# Altium schematic sheet REVISION_HISTORY.SchDoc
size 558 x 431 mm
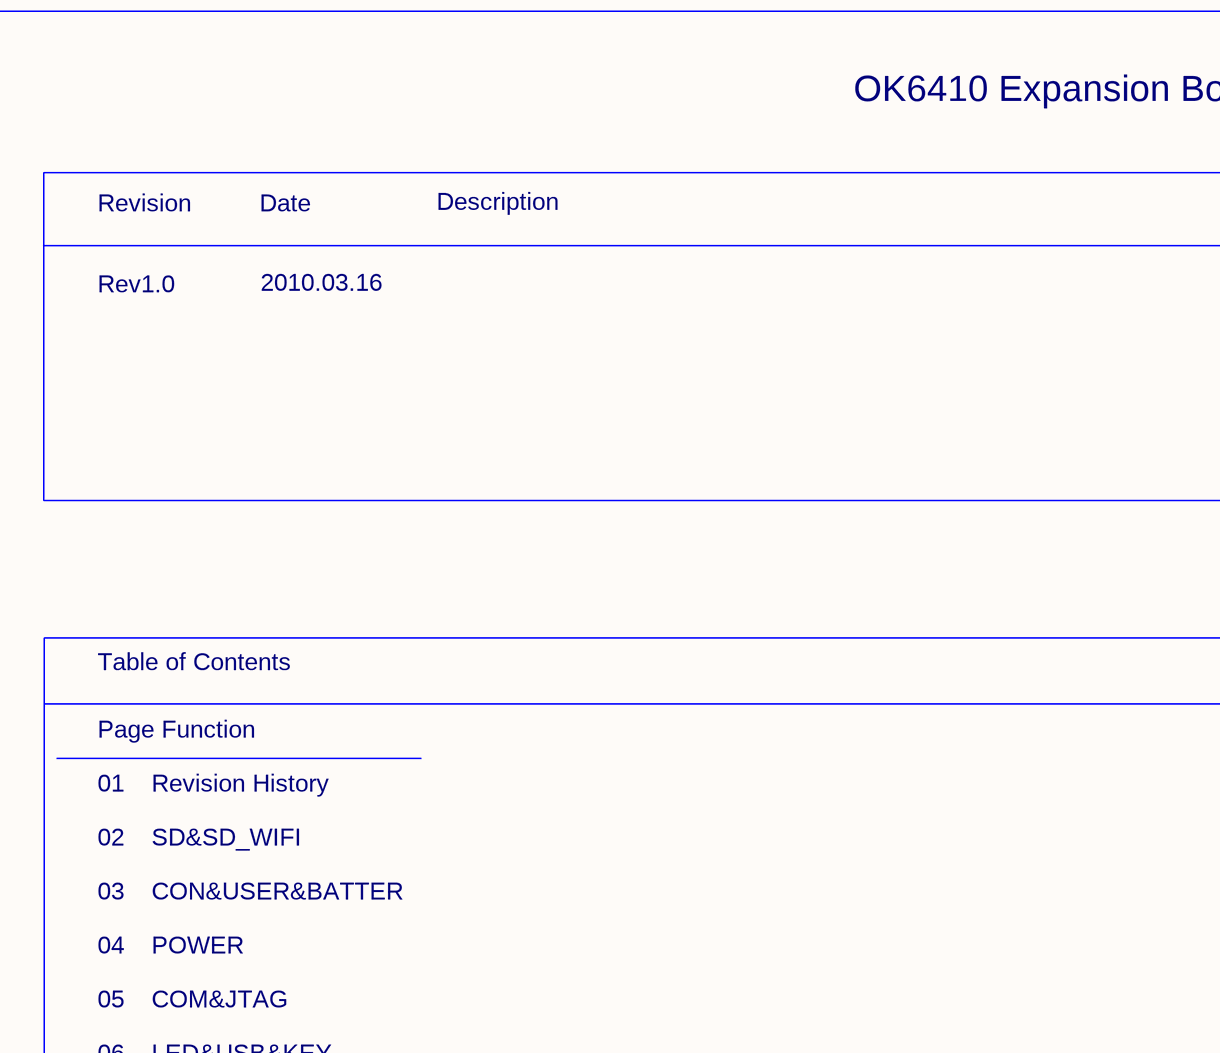
[diagram p0: REVISION_HISTORY.SchDoc, top left]
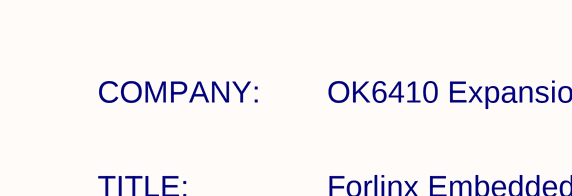
[diagram p1: REVISION_HISTORY.SchDoc, top right]
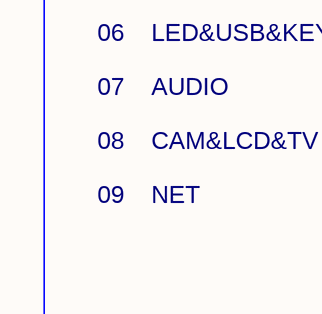
[diagram p2: REVISION_HISTORY.SchDoc, bottom left]
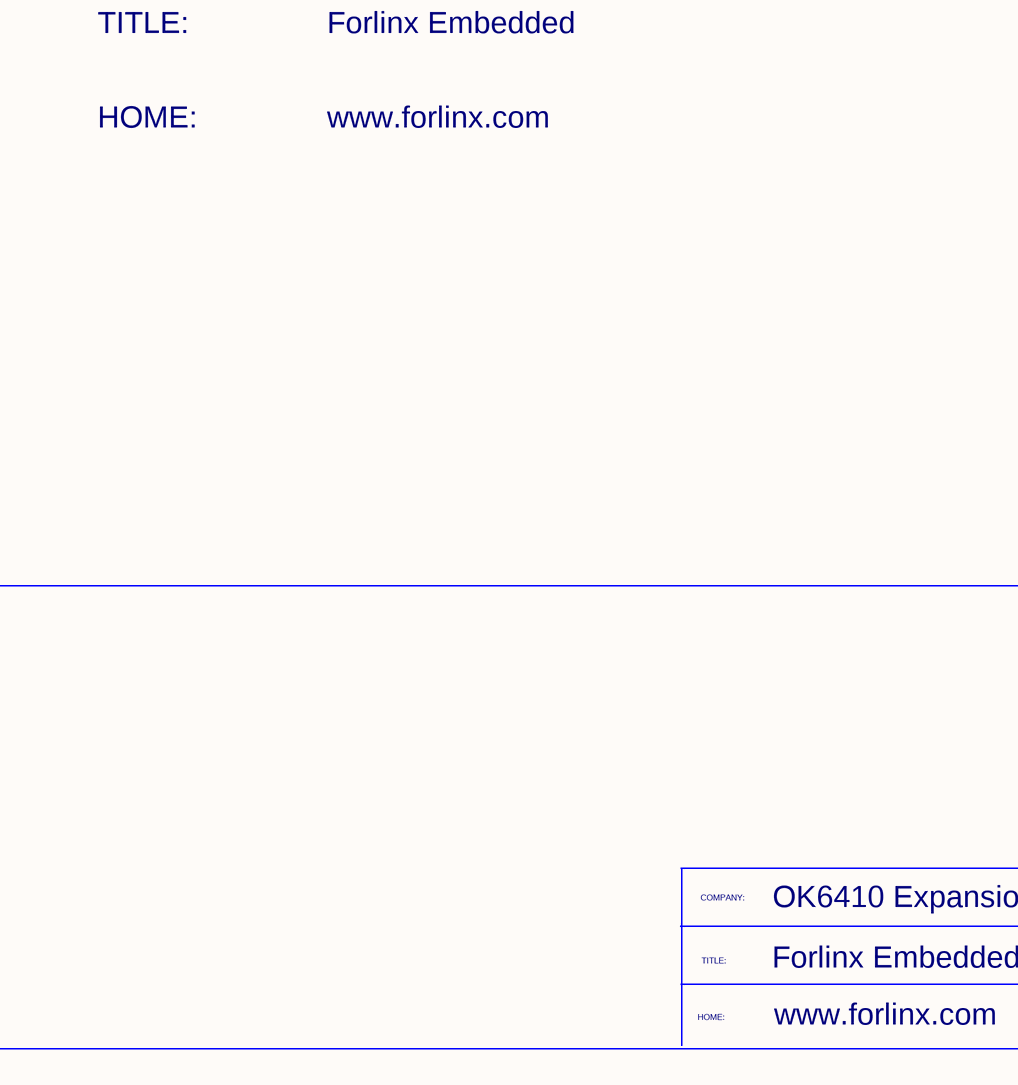
[diagram p3: REVISION_HISTORY.SchDoc, bottom right]

## Notes on the sheet
- OK6410 Expansion Board Schematic Diagram
- Revision
- Date
- Description
- Rev1.0
- 2010.03.16
- Table of Contents
- Page Function
- 01
- Revision History
- 02
- 03
- SD&SD_WIFI
- CON&USER&BATTER
- 04
- POWER
- COMPANY:
- OK6410 Expansion Board
- 05
- COM&JTAG
- 06
- LED&USB&KEY
- TITLE:
- Forlinx Embedded
- 07
- 08
- AUDIO
- CAM&LCD&TV
- HOME:
- www.forlinx.com
- 09
- NET